# EAGLE design teensy_shield (EAGLE 7.2.0)
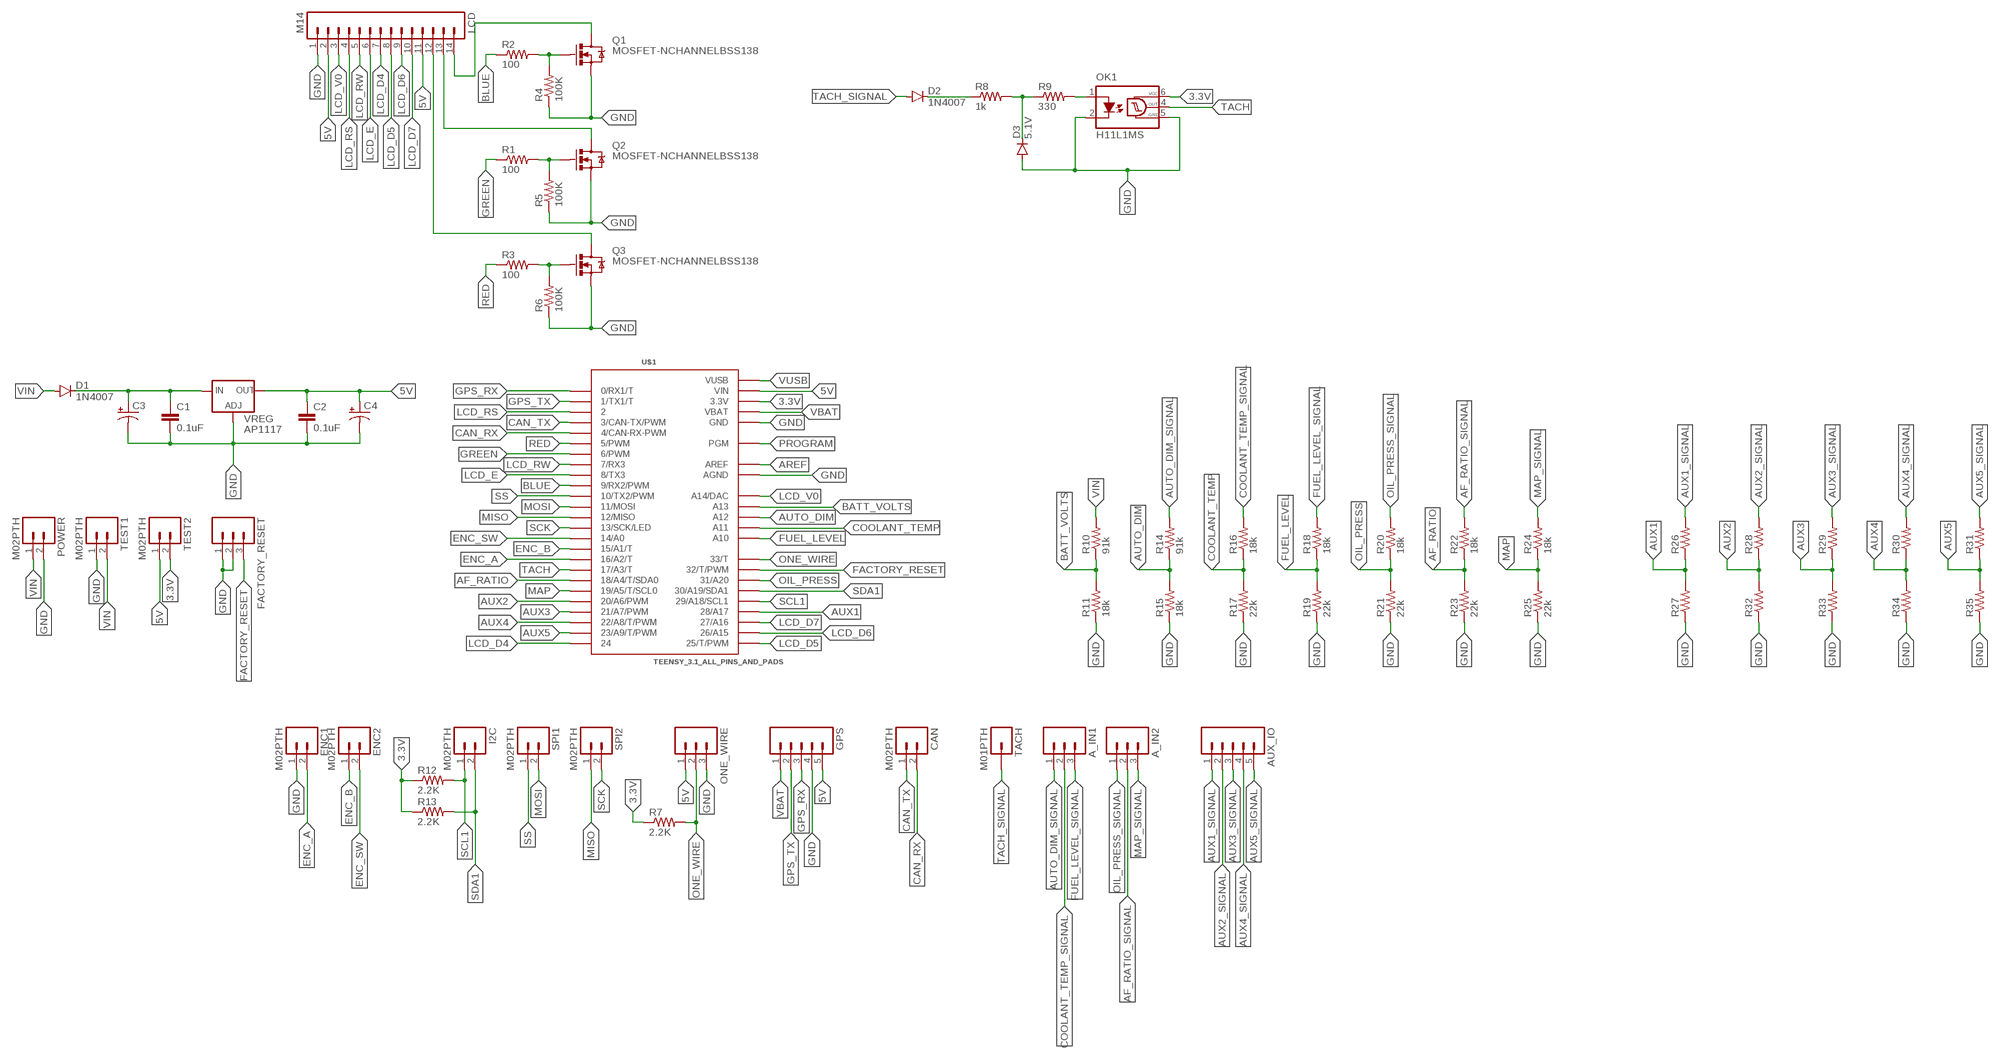
[diagram p0: schematic, sheet 1]

## Parts
A_IN1  M03PTH  [1X03]
A_IN2  M03PTH  [1X03]
AUX_IO  M05PTH  [1X05]
C1  0.1uF  CAP1206  [1206]
C2  0.1uF  CAP1206  [1206]
C3  CAP_POL6032  [EIA6032]
C4  CAP_POL6032  [EIA6032]
CAN  M02PTH  [1X02]
D1  1N4007  DIODESMA-ALT  [SMA-DIODE_ALT]
D2  1N4007  DIODESMA-ALT  [SMA-DIODE_ALT]
D3  5.1V  DIODESMA-ALT  [SMA-DIODE_ALT]
ENC1  M02PTH  [1X02]
ENC2  M02PTH  [1X02]
FACTORY_RESET  M03PTH  [1X03]
GPS  M05PTH  [1X05]
I2C  M02PTH  [1X02]
LCD  M14  [1X14]
OK1  H11L1MS  [DIL6-SMD]
ONE_WIRE  M03PTH  [1X03]
POWER  M02PTH  [1X02]
Q1  MOSFET-NCHANNELBSS138  [SOT23]
Q2  MOSFET-NCHANNELBSS138  [SOT23]
Q3  MOSFET-NCHANNELBSS138  [SOT23]
R1  100  RESISTOR1206  [1206]
R2  100  RESISTOR1206  [1206]
R3  100  RESISTOR1206  [1206]
R4  100K  RESISTOR1206  [1206]
R5  100K  RESISTOR1206  [1206]
R6  100K  RESISTOR1206  [1206]
R7  2.2K  RESISTOR1206  [1206]
R8  1k  RESISTOR1206  [1206]
R9  330  RESISTOR1206  [1206]
R10  91k  RESISTOR1206  [1206]
R11  18k  RESISTOR1206  [1206]
R12  2.2K  RESISTOR1206  [1206]
R13  2.2K  RESISTOR1206  [1206]
R14  91k  RESISTOR1206  [1206]
R15  18k  RESISTOR1206  [1206]
R16  18k  RESISTOR1206  [1206]
R17  22k  RESISTOR1206  [1206]
R18  18k  RESISTOR1206  [1206]
R19  22k  RESISTOR1206  [1206]
R20  18k  RESISTOR1206  [1206]
R21  22k  RESISTOR1206  [1206]
R22  18k  RESISTOR1206  [1206]
R23  22k  RESISTOR1206  [1206]
R24  18k  RESISTOR1206  [1206]
R25  22k  RESISTOR1206  [1206]
R26  RESISTOR1206  [1206]
R27  RESISTOR1206  [1206]
R28  RESISTOR1206  [1206]
R29  RESISTOR1206  [1206]
R30  RESISTOR1206  [1206]
R31  RESISTOR1206  [1206]
R32  RESISTOR1206  [1206]
R33  RESISTOR1206  [1206]
R34  RESISTOR1206  [1206]
R35  RESISTOR1206  [1206]
SPI1  M02PTH  [1X02]
SPI2  M02PTH  [1X02]
TACH  M01PTH  [1X01]
TEST1  M02PTH  [1X02]
TEST2  M02PTH  [1X02]
U$1  TEENSY_3.1_ALL_PINS_AND_PADS  [TEENSY_3.1_ALLPINS]
VREG  AP1117  V_REG_317SMD  [SOT223]

## Nets
3.3V: OK1.6(VCC) R7.1 R12.1 R13.1 TEST2.2 U$1.3.3V U$1.3.3V1(3.3V) U$1.3.3V2(3.3V)
5V: C2.1 C4.P$1(+) GPS.5 LCD.2 LCD.11 ONE_WIRE.1 TEST2.1 U$1.VIN VREG.2(OUT)
AF_RATIO: R22.1 R23.2 U$1.18/A4(18/A4/T/SDA0)
AF_RATIO_SIGNAL: A_IN2.2 R22.2
AREF: U$1.AREF
AUTO_DIM: R14.1 R15.2 U$1.A12
AUTO_DIM_SIGNAL: A_IN1.1 R14.2
AUX1: R26.1 R27.2 U$1.28(28/A17)
AUX1_SIGNAL: AUX_IO.1 R26.2
AUX2: R28.1 R32.2 U$1.20/A6(20/A6/PWM)
AUX2_SIGNAL: AUX_IO.2 R28.2
AUX3: R29.1 R33.2 U$1.21/A7(21/A7/PWM)
AUX3_SIGNAL: AUX_IO.3 R29.2
AUX4: R30.1 R34.2 U$1.22/A8(22/A8/T/PWM)
AUX4_SIGNAL: AUX_IO.4 R30.2
AUX5: R31.1 R35.2 U$1.23/A9(23/A9/T/PWM)
AUX5_SIGNAL: AUX_IO.5 R31.2
BATT_VOLTS: R10.1 R11.2 U$1.A13
BLUE: R2.1 U$1.9(9/RX2/PWM)
CAN_RX: CAN.2 U$1.4(4/CAN-RX-PWM)
CAN_TX: CAN.1 U$1.3(3/CAN-TX/PWM)
COOLANT_TEMP: R16.1 R17.2 U$1.A11
COOLANT_TEMP_SIGNAL: A_IN1.2 R16.2
ENC_A: ENC1.2 U$1.16/A2(16/A2/T)
ENC_B: ENC2.1 U$1.15/A1(15/A1/T)
ENC_SW: ENC2.2 U$1.14/A0
FACTORY_RESET: FACTORY_RESET.3 U$1.32(32/T/PWM)
FUEL_LEVEL: R18.1 R19.2 U$1.A10
FUEL_LEVEL_SIGNAL: A_IN1.3 R18.2
GND: C1.2 C2.2 C3.P$2(-) C4.P$2(-) D3.A ENC1.1 FACTORY_RESET.1 FACTORY_RESET.2 GPS.4 LCD.1 OK1.2(C) OK1.5(GND) ONE_WIRE.3 POWER.2 Q1.2(S) Q2.2(S) Q3.2(S) R4.1 R5.1 R6.1 R11.1 R15.1 R17.1 R19.1 R21.1 R23.1 R25.1 R27.1 R32.1 R33.1 R34.1 R35.1 TEST1.1 U$1.AGND U$1.GND U$1.GND1(GND) U$1.GND2(GND) VREG.1(ADJ)
GPS_RX: GPS.3 U$1.0(0/RX1/T)
GPS_TX: GPS.2 U$1.1(1/TX1/T)
GREEN: R1.1 U$1.6(6/PWM)
LCD_D4: LCD.7 U$1.24
LCD_D5: LCD.8 U$1.25(25/T/PWM)
LCD_D6: LCD.9 U$1.26(26/A15)
LCD_D7: LCD.10 U$1.27(27/A16)
LCD_E: LCD.6 U$1.8(8/TX3)
LCD_RS: LCD.4 U$1.2
LCD_RW: LCD.5 U$1.7(7/RX3)
LCD_V0: LCD.3 U$1.A14(A14/DAC)
MAP: R24.1 R25.2 U$1.19/A5(19/A5/T/SCL0)
MAP_SIGNAL: A_IN2.3 R24.2
MISO: SPI2.1 U$1.12(12/MISO)
MOSI: SPI1.2 U$1.11(11/MOSI)
N$1: C1.1 C3.P$1(+) D1.C VREG.3(IN)
N$2: D2.C R8.1
N$3: D3.C R8.2 R9.1
N$5: OK1.1(A) R9.2
N$11: LCD.14 Q1.3(D)
N$46: LCD.13 Q2.3(D)
N$47: LCD.12 Q3.3(D)
N$48: Q1.1(G) R2.2 R4.2
N$51: Q2.1(G) R1.2 R5.2
N$52: Q3.1(G) R3.2 R6.2
OIL_PRESS: R20.1 R21.2 U$1.31(31/A20)
OIL_PRESS_SIGNAL: A_IN2.1 R20.2
ONE_WIRE: ONE_WIRE.2 R7.2 U$1.33(33/T)
PROGRAM: U$1.PGM
RED: R3.1 U$1.5(5/PWM)
SCK: SPI2.2 U$1.13(13/SCK/LED)
SCL1: I2C.1 R12.2 U$1.29(29/A18/SCL1)
SDA1: I2C.2 R13.2 U$1.30(30/A19/SDA1)
SS: SPI1.1 U$1.10(10/TX2/PWM)
TACH: OK1.4(OUT) U$1.17/A3(17/A3/T)
TACH_SIGNAL: D2.A TACH.1
VBAT: GPS.1 U$1.VBAT
VIN: D1.A POWER.1 R10.2 TEST1.2
VUSB: U$1.VUSB

## Library data of the parts
A_IN1 A_IN2 FACTORY_RESET ONE_WIRE = SparkFun-Connectors:M03: Header 3 Standard 3-pin 0.1" header. Use with straight break away headers (SKU : PRT-00116), right angle break away headers (PRT-00553), swiss pins (PRT-00743), machine pins (PRT-00117), and female headers (PRT-00115). Molex polarized connector foot print use with SKU : PRT-08232 with associated crimp pins and housings.
AUX_IO GPS = SparkFun-Connectors:M05: Header 5 Standard 5-pin 0.1" header. Use with straight break away headers (SKU : PRT-00116), right angle break away headers (PRT-00553), swiss pins (PRT-00743), machine pins (PRT-00117), and female headers (PRT-00115). Molex polarized connector foot print use with SKU : PRT-08230 with associated crimp pins and housings.
C1 C2 = SparkFun-Capacitors:CAP: Capacitor Standard 0603 ceramic capacitor, and 0.1" leaded capacitor.
C3 C4 = SparkFun-Capacitors:CAP_POL: Capacitor Polarized These are standard SMD and PTH capacitors. Normally 10uF, 47uF, and 100uF in electrolytic and tantalum varieties. Always verify the external diameter of the through hole cap, it varies with capacity, voltage, and manufacturer. The EIA devices should be standard.
CAN ENC1 ENC2 I2C POWER SPI1 SPI2 TEST1 TEST2 = SparkFun-Connectors:M02: Standard 2-pin 0.1" header. Use with - straight break away headers ( PRT-00116) - right angle break away headers (PRT-00553) - swiss pins (PRT-00743) - machine pins (PRT-00117) - female headers (PRT-00115) Molex polarized connector foot print use with: PRT-08233 with associated crimp pins and housings. 2.54_SCREWTERM for use with PRT-10571. 3.5mm Screw Terminal footprints for PRT-08084 5mm Screw Terminal footprints for use with PRT-08433
D1-D3 = SparkFun-DiscreteSemi:DIODE: Diode These are standard reverse protection diodes and small signal diodes. SMA package can handle up to about 1A. SOD-323 can handle about 200mA. What the SOD-323 package when ordering, there are some mfgs out there that are 5-pin packages.
LCD = SparkFun-Connectors:M14: Header 14 Standard 14-pin 0.1" header. Use with straight break away headers (SKU : PRT-00116), right angle break away headers (PRT-00553), swiss pins (PRT-00743), machine pins (PRT-00117), and female headers (PRT-00115).
OK1 = optocoupler:H11L*M: 6-Pin DIP Optocoupler Source: http://www.fairchildsemi.com/ds/H1/H11L2-M.pdf; OC_FARNELL: unknown; OC_NEWARK: unknown
Q1-Q3 = SparkFun-DiscreteSemi:MOSFET-NCHANNEL: Common NMOSFET Parts MFG P/N Store ID Prod ID FDD8780 TRANS-09984 SI7820DN TRANS-11055 FDS6630A IC-08089 2N7002PW TRANS-11151 FQP30N06L COM-10213 TRANS-10060 BSS123LT1G TRANS-08345 BSS138 TRANS-00830 BS170 2N7000; PROD_ID: TRANS-00830
R1-R35 = SparkFun-Resistors:RESISTOR: Resistor Basic schematic elements and footprints for 0603, 1206, and PTH resistors.
TACH = SparkFun-Connectors:M01: Header 1 Standard 1-pin 0.1" header. Use with straight break away headers (SKU : PRT-00116), right angle break away headers (PRT-00553), swiss pins (PRT-00743), machine pins (PRT-00117), and female headers (PRT-00115).
U$1 = Teensy_3_Series_Board_v1.0:TEENSY_3.1_ALL_PINS_AND_PADS: Footprint for Teensy 3.1 board using all pads and all through-holes. Pads need a 2x7 0.1" SMD header.
VREG = SparkFun-PowerIC:V_REG_317: Voltage Regulator Standard LM317 adjustable voltage regulator. AOI (Adjust Output Input). Google 'LM317 Calculator' for easy to use app to get the two resistor values needed. 240/720 for 5V output. 240/390 for 3.3V output. Spark Fun Electronics SKU : COM-00527

## Board
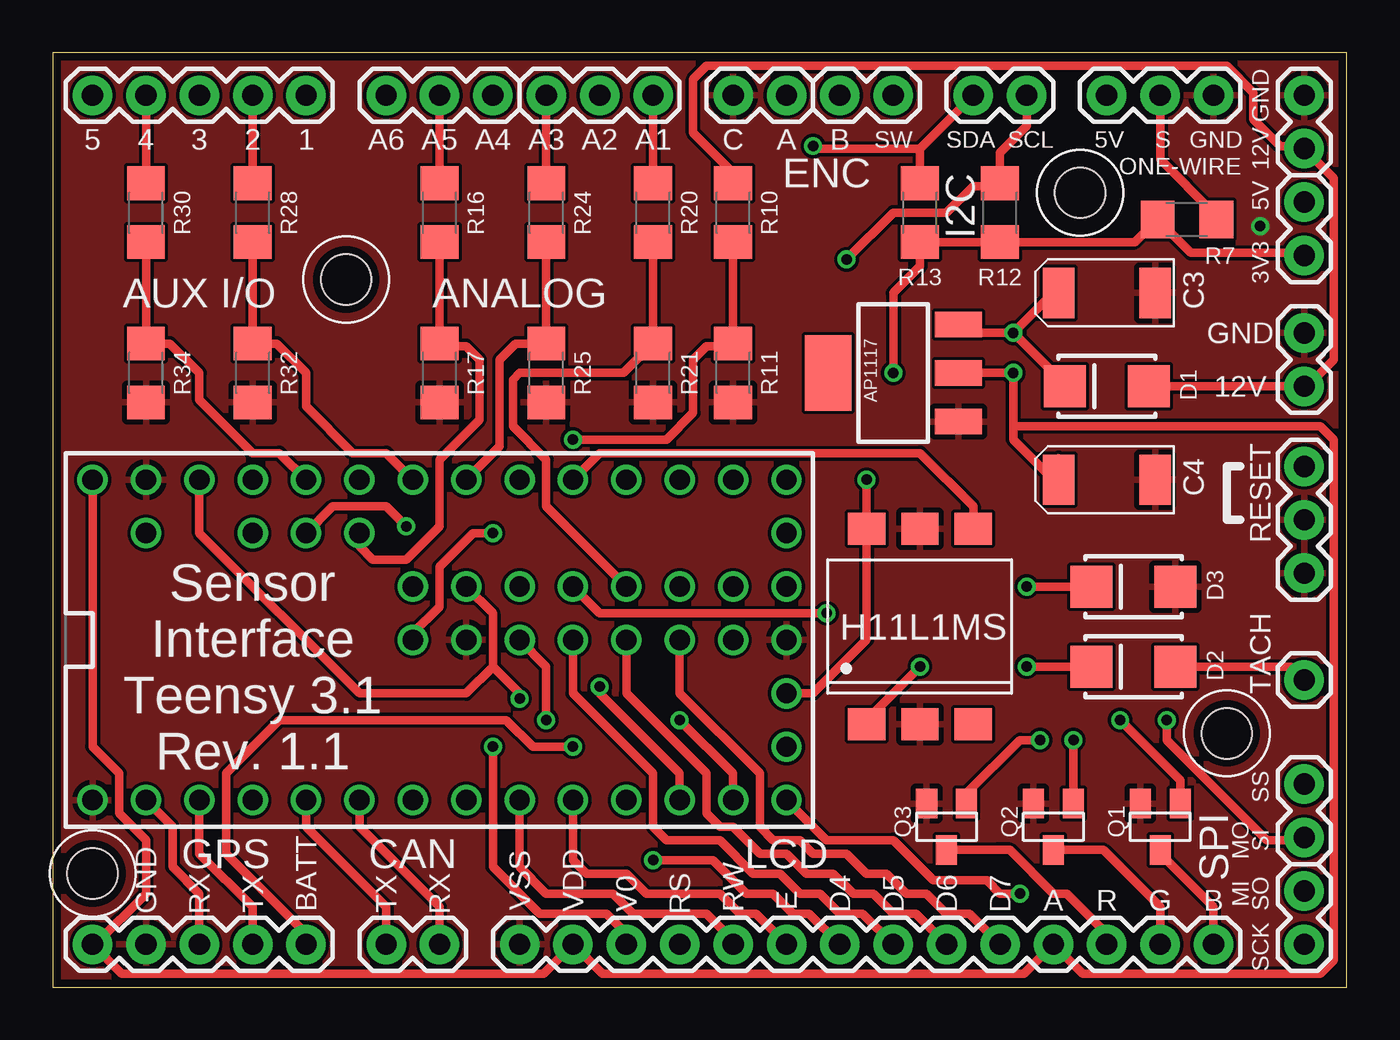
[diagram p1: board, top side]
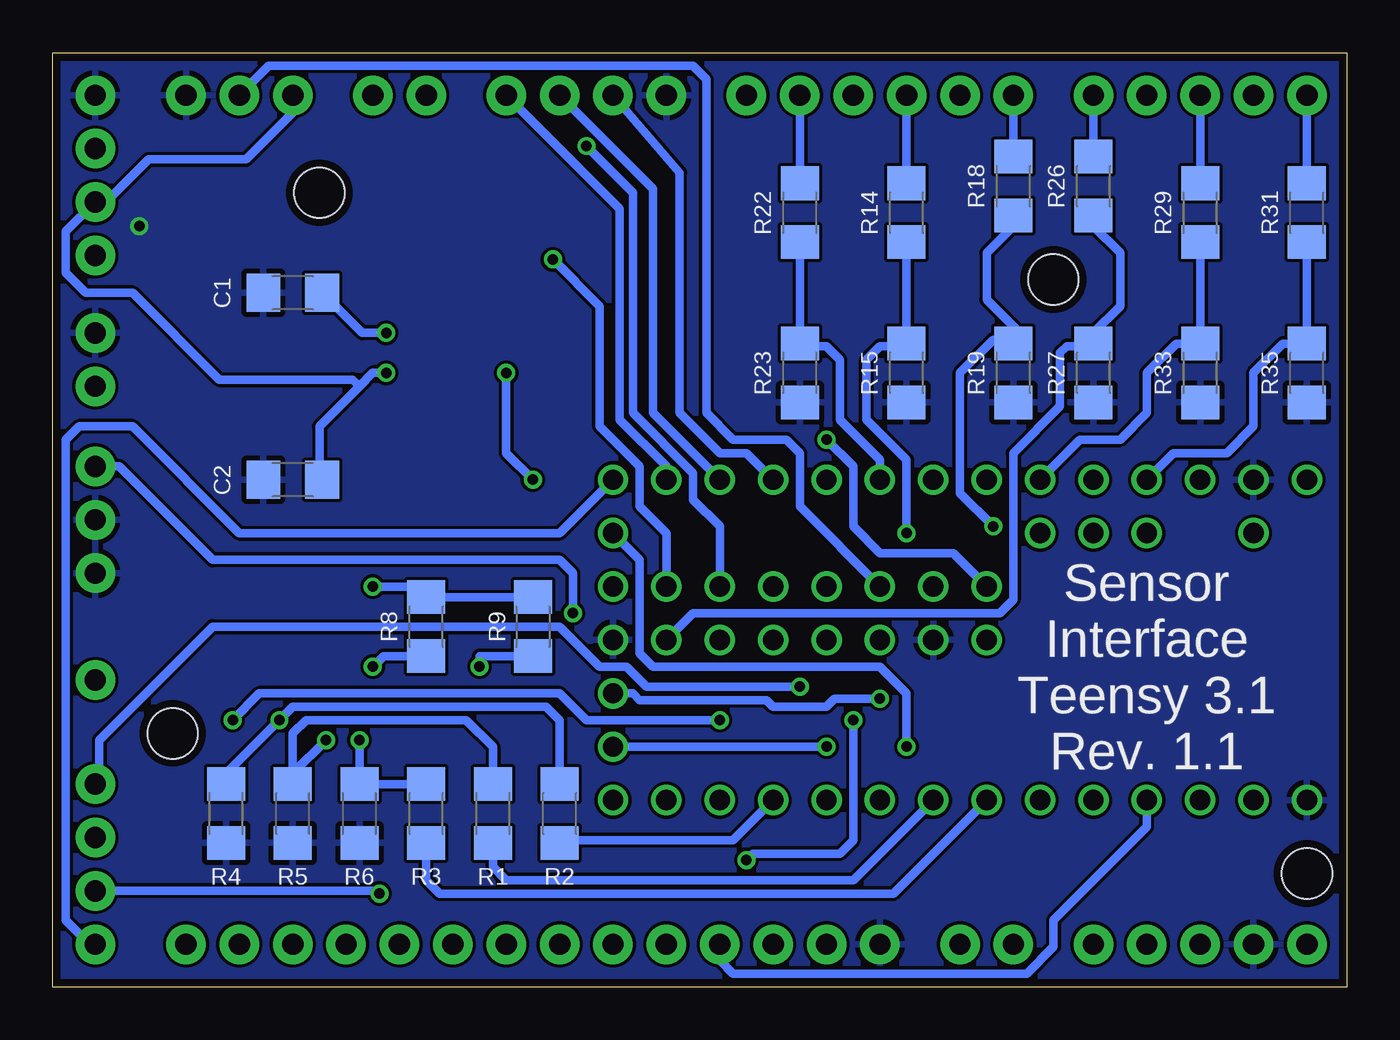
[diagram p2: board, bottom side, seen from below]

Size 61.59 x 44.45 mm. Coordinates in mm from the lower left corner, seen from the top.
Outline: 0,0 61.59,0 61.59,44.45 0,44.45 0,0
Copper layers (1*16): Top 0.0356mm / dielectric 1.5011mm / Bottom 0.0356mm
Design rules "oshparkPCB": minimum track width 6mil, minimum drill 13mil, track to track 6mil, track to pad 6mil, pad to pad 6mil, via to via 6mil, smd to smd 6mil, copper to edge 15mil, drill to drill 6mil, minimum pad ring 7mil, minimum via ring 7mil, stop-mask expansion 3mil, vias tented up to drill 0mil, thermal gap 10mil
Holes 2.39 mm at 1.91,5.4 13.97,33.66 48.9,37.78 55.88,12.06

### Footprints (pad centres in the part's own frame; a part is rotated, then mirrored left to right if it is on the bottom)
1X03 = drill 1.016 pad 1.88: 1 0,0; 2 2.54,0; 3 5.08,0
1X05 = drill 1.016 pad 1.88: 1 0,0; 2 2.54,0; 3 5.08,0; 4 7.62,0; 5 10.16,0
1206 = smd 1.6 x 1.8: 1 -1.4,0; 2 1.4,0
EIA6032 = smd 1.5 x 2.4: P$1 -2.3,0; P$2 2.3,0
1X02 = drill 1.016 pad 1.88: 1 0,0; 2 2.54,0
SMA-DIODE_ALT = smd 2 x 2: A -2,0; C 2,0
1X14 = drill 1.016 pad 1.88: 1 0,0; 2 2.54,0; 3 5.08,0; 4 7.62,0; 5 10.16,0; 6 12.7,0; 7 15.24,0; 8 17.78,0; 9 20.32,0; 10 22.86,0; 11 25.4,0; 12 27.94,0; 13 30.48,0; 14 33.02,0
DIL6-SMD = smd 1.78 x 1.52: 1 -2.54,-4.645; 2 0,-4.645; 3 2.54,-4.645; 4 2.54,4.645; 5 0,4.645; 6 -2.54,4.645
SOT23 = smd 1 x 1.4: 1 -0.95,-1.1; 2 0.95,-1.1; 3 0,1.1
1X01 = drill 1.016 pad 1.88: 1 0,0
TEENSY_3.1_ALLPINS = drill 0.965: 0 -7.62,15.24; 1 -7.62,12.7; 2 -7.62,10.16; 3 -7.62,7.62; 3.3V 7.62,12.7; 3.3V1 -2.54,-15.24; 3.3V2 2.54,0; 4 -7.62,5.08; 5 -7.62,2.54; 6 -7.62,0; 7 -7.62,-2.54; 8 -7.62,-5.08; 9 -7.62,-7.62; 10 -7.62,-10.16; 11 -7.62,-12.7; 12 -7.62,-15.24; 13 7.62,-15.24; 14/A0 7.62,-12.7; 15/A1 7.62,-10.16; 16/A2 7.62,-7.62; 17/A3 7.62,-5.08; 18/A4 7.62,-2.54; 19/A5 7.62,0; 20/A6 7.62,2.54; 21/A7 7.62,5.08; 22/A8 7.62,7.62; 23/A9 7.62,10.16; 24 0,-2.54; 25 0,-5.08; 26 0,-7.62; 27 0,-10.16; 28 0,-12.7; 29 2.54,-12.7; 30 2.54,-10.16; 31 2.54,-7.62; 32 2.54,-5.08; 33 2.54,-2.54; A10 5.08,7.62; A11 5.08,5.08; A12 0,2.54; A13 2.54,2.54; A14 5.08,-15.24; AGND 7.62,15.24; AREF 5.08,10.16; GND -7.62,17.78; GND1 0,-15.24; GND2 0,0; PGM 2.54,-15.24; VBAT -5.08,-15.24; VIN 7.62,17.78; VUSB 5.08,15.24
SOT223 = smd 1.219 x 2.235: 1 -2.311,-3.099; 2 0,-3.099; 3 2.311,-3.099 | smd 3.6 x 2.2: 4 0,3.099

### Placement (x,y rotation side)
A_IN1  20.95,42.42 180 top
A_IN2  28.57,42.42 180 top
AUX_IO  12.06,42.42 180 top
C1  50.16,33.02 180 bottom
C2  50.16,24.13 180 bottom
C3  50.16,33.02 0 top
C4  50.16,24.13 0 top
CAN  15.88,2.03 0 top
D1  50.16,28.57 180 top
D2  51.44,15.24 180 top
D3  51.44,19.05 180 top
ENC1  32.38,42.42 0 top
ENC2  37.47,42.42 0 top
FACTORY_RESET  59.56,19.68 90 top
GPS  12.06,2.03 180 top
I2C  46.35,42.42 180 top
LCD  22.23,2.03 0 top
OK1  41.27,17.14 0 top
ONE_WIRE  50.16,42.42 0 top
POWER  59.56,28.57 90 top
Q1  52.7,7.62 180 top
Q2  47.62,7.62 180 top
Q3  42.55,7.62 180 top
R1  40.64,8.26 90 bottom
R2  37.47,8.26 90 bottom
R3  43.81,8.26 90 bottom
R4  53.34,8.26 90 bottom
R5  50.16,8.26 90 bottom
R6  46.99,8.26 90 bottom
R7  53.98,36.51 0 top
R8  43.81,17.14 90 bottom
R9  38.73,17.14 270 bottom
R10  32.38,36.83 90 top
R11  32.38,29.21 90 top
R12  45.09,36.83 90 top
R13  41.27,36.83 90 top
R14  20.95,36.83 90 bottom
R15  20.95,29.21 90 bottom
R16  18.41,36.83 90 top
R17  18.41,29.21 90 top
R18  15.88,38.1 90 bottom
R19  15.88,29.21 90 bottom
R20  28.57,36.83 90 top
R21  28.57,29.21 90 top
R22  26.04,36.83 90 bottom
R23  26.04,29.21 90 bottom
R24  23.5,36.83 90 top
R25  23.5,29.21 90 top
R26  12.06,38.1 90 bottom
R27  12.06,29.21 90 bottom
R28  9.53,36.83 90 top
R29  6.99,36.83 90 bottom
R30  4.45,36.83 90 top
R31  1.91,36.83 90 bottom
R32  9.53,29.21 90 top
R33  6.99,29.21 90 bottom
R34  4.45,29.21 90 top
R35  1.91,29.21 90 bottom
SPI1  59.56,9.65 270 top
SPI2  59.56,4.57 270 top
TACH  59.56,14.61 90 top
TEST1  59.56,42.42 270 top
TEST2  59.56,37.34 270 top
U$1  19.68,16.51 90 top
VREG  40.01,29.21 90 top

### Tracks (layer width: path | path; a pad name or v marks a point on that pad's centre or on a via)
3.3V  (via drill 0.5 pad 0.25)
  Top 0.406: U$1.3.3V1 36.2,13.97 38.73,16.51 OK1.6 v38.73,24.13 | v40.01,29.21 40.01,33.02 41.27,34.29 R13.1 R12.1 51.49,35.43 R7.1 | U$1.3.3V2 20.95,17.78 20.95,15.24 | 20.95,15.24 19.68,13.97 14.61,13.97 6.99,21.59 U$1.3.3V | v22.23,13.72 22.23,13.97 20.95,15.24 | R7.1 53.02,36.51 | TEST2.2 59.44,34.92 54.16,34.92 R7.1
  Bottom 0.406: v40.01,29.21 40.01,25.4 v38.73,24.13 | U$1.3.3V1 33.97,13.97 33.66,13.65 27.62,13.65 27.3,13.34 24.77,13.34 24.38,13.72 v22.23,13.72
5V  (via drill 0.5 pad 0.25)
  Top 0.406: U$1.VIN 1.91,11.43 3.17,10.16 3.17,8.26 4.45,6.99 4.45,4.45 2.03,2.03 GPS.5 3.3,0.64 23.37,0.64 LCD.2 26.16,0.64 46.23,0.64 LCD.11 49.02,0.64 60.33,0.64 60.96,1.27 60.96,26.04 60.33,26.67 45.72,26.67 | 47.87,25.16 C4.P$1 47.62,24.13 45.72,26.04 45.72,26.67 | VREG.2 v45.72,29.21 45.72,26.67
  Bottom 0.406: v45.72,29.21 46.35,29.21 46.99,28.57 | 46.99,28.57 48.9,26.67 48.9,24.26 C2.1 | ONE_WIRE.1 50.16,41.59 52.39,39.37 57.02,39.37 59.05,37.34 TEST2.1 60.96,35.94 60.96,33.97 60.01,33.02 57.78,33.02 53.66,28.89 47.31,28.89 46.99,28.57
AF_RATIO
  Bottom 0.406: R22.1 R23.2 25.91,30.48 24.77,30.48 24.13,29.84 24.13,26.99 22.23,25.08 U$1.18/A4
AF_RATIO_SIGNAL
  Bottom 0.406: A_IN2.2 R22.2
AUTO_DIM  (via drill 0.5 pad 0.25)
  Top 0.406: U$1.A12 17.14,16.83 18.41,18.1 18.41,20 20,21.59 v20.95,21.59
  Bottom 0.406: R14.1 R15.2 21.09,30.48 22.23,30.48 22.86,29.84 22.86,26.99 20.95,25.08 v20.95,21.59
AUTO_DIM_SIGNAL
  Bottom 0.406: A_IN1.1 R14.2
AUX1
  Bottom 0.406: U$1.28 31.11,17.78 16.51,17.78 15.88,18.41 15.88,25.4 13.65,27.62 13.65,30.16 13.34,30.48 12.2,30.48 R27.2 12.06,31.11 10.79,32.38 10.79,34.92 12.06,36.2 R26.1
AUX1_SIGNAL
  Bottom 0.406: AUX_IO.1 R26.2
AUX2
  Top 0.406: R28.1 R32.2 10.66,30.61 12.06,29.21 12.06,27.62 14.29,25.4 15.88,25.4 U$1.20/A6
AUX2_SIGNAL
  Top 0.406: AUX_IO.2 R28.2
AUX3
  Bottom 0.406: R29.1 R33.2 8.12,30.61 9.53,29.21 9.53,27.3 10.79,26.04 12.7,26.04 U$1.21/A7
AUX3_SIGNAL
  Bottom 0.406: AUX_IO.3 R29.2
AUX4
  Top 0.406: R30.1 R34.2 5.58,30.61 6.99,29.21 6.99,27.94 9.53,25.4 10.79,25.4 U$1.22/A8
AUX4_SIGNAL
  Top 0.406: AUX_IO.4 R30.2
AUX5
  Bottom 0.406: R31.1 R35.2 3.04,30.61 4.45,29.21 4.45,26.67 5.71,25.4 8.26,25.4 U$1.23/A9
AUX5_SIGNAL
  Bottom 0.406: AUX_IO.5 R31.2
BATT_VOLTS  (via drill 0.5 pad 0.25)
  Top 0.406: R10.1 R11.2 32.26,30.48 31.11,30.48 30.48,29.84 30.48,27.3 29.21,26.04 v24.77,26.04
  Bottom 0.406: v24.77,26.04 23.5,24.77 23.5,21.91 22.23,20.64 18.73,20.64 U$1.A13
BLUE
  Bottom 0.406: 37.47,6.35 R2.1 37.34,6.99 29.21,6.99 U$1.9
CAN_RX
  Top 0.406: CAN.2 18.41,3.81 14.61,7.62 U$1.4
CAN_TX
  Top 0.406: U$1.3 12.06,7.62 15.88,3.81 CAN.1
COOLANT_TEMP
  Top 0.406: 18.29,30.48 R17.2 | R16.1 R17.2 | R17.2 18.55,30.48 19.68,30.48 20.32,29.84 20.32,26.99 18.41,25.08 18.41,21.91 16.83,20.32 15.24,20.32 14.61,20.95 U$1.A11
COOLANT_TEMP_SIGNAL
  Top 0.406: A_IN1.2 R16.2
ENC_A
  Bottom 0.406: U$1.16/A2 28.57,25.4 29.84,25.4 31.75,27.3 31.75,38.73 ENC1.2
ENC_B
  Bottom 0.406: U$1.15/A1 33.02,27.3 33.02,37.97 ENC2.1
ENC_SW
  Bottom 0.406: U$1.14/A0 32.38,24.77 34.61,26.99 34.61,37.02 ENC2.2
FACTORY_RESET  (via drill 0.5 pad 0.25)
  Top 0.406: U$1.32 26.04,17.78 v36.83,17.78
  Bottom 0.406: v36.83,17.78 36.83,19.68 37.47,20.32 53.98,20.32 58.42,24.77 FACTORY_RESET.3
FUEL_LEVEL  (via drill 0.5 pad 0.25)
  Top 0.406: U$1.A10 13.34,22.86 15.88,22.86 v16.83,21.91
  Bottom 0.406: 16,30.48 R19.2 | R18.1 15.88,36.2 17.14,34.92 17.14,32.7 15.56,31.11 15.56,30.93 R19.2 | R19.2 16.06,30.8 16.83,30.8 18.41,29.21 18.41,23.5 v16.83,21.91
FUEL_LEVEL_SIGNAL
  Bottom 0.406: A_IN1.3 R18.2
GND  (via drill 0.5 pad 0.25)
  other vias: 57.47,36.2
  pour Bottom: -2.54,48.26 63.5,48.26 63.5,0 -1.27,0
  pour Top: -1.27,46.99 63.5,46.99 63.5,-1.27 -1.27,-1.27
GPS_RX
  Top 0.406: U$1.0 5.71,7.62 5.71,5.71 6.99,4.45 GPS.3
GPS_TX
  Top 0.406: U$1.1 6.99,6.35 9.53,3.81 GPS.2
GREEN
  Bottom 0.406: U$1.6 23.5,5.08 40.01,5.08 40.64,5.71 R1.1
LCD_D4  (via drill 0.5 pad 0.25)
  Top 0.406: U$1.24 23.5,15.24 v23.5,12.7 | v28.57,6.03 31.43,6.03 33.02,4.45 34.29,4.45 35.24,3.49 36.01,3.49 LCD.7
  Bottom 0.406: v23.5,12.7 23.5,6.99 24.13,6.35 28.26,6.35 v28.57,6.03
LCD_D5
  Top 0.406: U$1.25 24.77,13.97 28.57,10.16 28.57,7.62 29.21,6.99 31.75,6.99 33.34,5.4 34.61,5.4 35.56,4.45 36.51,4.45 37.47,3.49 38.54,3.49 LCD.8
LCD_D6
  Top 0.406: U$1.26 27.3,13.97 31.11,10.16 31.11,8.26 31.75,7.62 32.38,7.62 33.66,6.35 34.92,6.35 35.88,5.4 37.15,5.4 38.1,4.45 39.05,4.45 40.01,3.49 41.08,3.49 LCD.9
LCD_D7
  Top 0.406: U$1.27 29.84,13.97 33.66,10.16 33.66,7.62 34.29,6.99 35.56,6.99 36.2,6.35 37.78,6.35 38.73,5.4 39.69,5.4 40.64,4.45 41.59,4.45 42.55,3.49 43.62,3.49 LCD.10
LCD_E
  Top 0.406: U$1.8 24.77,6.03 25.4,5.4 27.3,5.4 28.26,4.45 31.75,4.45 32.7,3.49 33.47,3.49 LCD.6
LCD_RS
  Bottom 0.406: LCD.4 29.84,1.27 29.21,0.64 15.24,0.64 13.97,1.91 13.97,3.17 9.53,7.62 U$1.2
LCD_RW
  Top 0.406: U$1.7 22.23,5.71 23.5,4.45 26.67,4.45 27.62,3.49 31.11,3.49 32.38,2.22 LCD.5
LCD_V0  (via drill 0.5 pad 0.25)
  Top 0.406: LCD.3 27.3,2.54 26.35,3.49 23.18,3.49 20.95,5.71 v20.95,11.43
  Bottom 0.406: U$1.A14 33.66,20.32 33.66,15.88 33.02,15.24 22.23,15.24 20.95,13.97 v20.95,11.43
MAP
  Top 0.406: R24.1 R25.2 22.04,30.61 21.27,29.84 21.27,25.72 U$1.19/A5
MAP_SIGNAL
  Top 0.406: A_IN2.3 R24.2
MISO  (via drill 0.5 pad 0.25)
  Top 0.406: U$1.12 36.83,6.99 40.01,6.99 41.91,5.08 44.45,5.08 45.09,4.45 v46.04,4.45
  Bottom 0.406: 59.44,4.45 SPI2.1 46.16,4.57 v46.04,4.45
MOSI  (via drill 0.5 pad 0.25)
  Top 0.406: U$1.11 32.38,10.16 v29.84,12.7 | SPI1.2 59.44,6.99 57.78,6.99 53.02,11.75 v53.02,12.7
  Bottom 0.406: v29.84,12.7 36.2,12.7 37.47,13.97 51.75,13.97 v53.02,12.7
N$1  (via drill 0.5 pad 0.25)
  Top 0.406: C3.P$1 47.62,33.02 v45.72,31.11 | v45.72,31.11 43.51,31.11 VREG.3 | D1.C 48.16,28.67 v45.72,31.11
  Bottom 0.406: v45.72,31.11 46.86,31.11 C1.1
N$2  (via drill 0.5 pad 0.25)
  Top 0.406: v46.35,15.24 D2.C
  Bottom 0.406: R8.1 45.85,15.74 v46.35,15.24
N$3  (via drill 0.5 pad 0.25)
  Top 0.406: D3.C v46.35,19.05
  Bottom 0.406: v46.35,19.05 44.32,19.05 R8.2 R9.1
N$5  (via drill 0.5 pad 0.25)
  Top 0.406: v41.27,15.24 38.73,12.7 OK1.1
  Bottom 0.406: R9.2 41.27,15.74 v41.27,15.24
N$11
  Top 0.406: Q1.3 52.7,6.35 55.24,3.81 LCD.14
N$46
  Top 0.406: Q2.3 49.99,6.52 52.7,3.81 LCD.13
N$47
  Top 0.406: Q3.3 44.45,6.52 44.91,6.52 45.55,6.52 47.62,4.45 48.26,4.45 50.16,2.54 LCD.12
N$48  (via drill 0.5 pad 0.25)
  Top 0.406: Q1.1 53.66,9.85 v50.8,12.7
  Bottom 0.406: R4.2 53.34,10.16 52.07,11.43 v50.8,12.7 50.16,13.34 38.1,13.34 37.47,12.7 R2.2
N$51  (via drill 0.5 pad 0.25)
  Top 0.406: Q2.1 v48.58,11.75
  Bottom 0.406: R5.2 50.16,10.16 | 50.16,10.16 50.16,12.06 49.53,12.7 41.91,12.7 40.64,11.43 R1.2 | v48.58,11.75 50.16,10.16
N$52  (via drill 0.5 pad 0.25)
  Top 0.406: Q3.1 43.49,9.21 46.04,11.75 v46.99,11.75
  Bottom 0.406: R3.2 R6.2 v46.99,11.75
OIL_PRESS
  Top 0.406: R20.1 R21.2 27.18,29.21 22.23,29.21 21.91,28.89 21.91,26.67 23.5,25.08 23.5,22.86 U$1.31
OIL_PRESS_SIGNAL
  Top 0.406: A_IN2.1 R20.2
ONE_WIRE
  Top 0.406: ONE_WIRE.2 52.7,39.37 55.24,36.83 55.24,36.64 R7.2
  Bottom 0.406: ONE_WIRE.2 51.31,43.81 31.11,43.81 30.48,43.18 30.48,27.3 29.21,26.04 26.67,26.04 26.04,25.4 26.04,22.86 U$1.33
RED
  Bottom 0.406: U$1.5 21.59,4.45 43.18,4.45 43.81,5.08 R3.1
SCK
  Bottom 0.406: U$1.13 37.47,21.59 52.7,21.59 57.78,26.67 60.33,26.67 60.96,26.04 60.96,3.17 59.82,2.03 SPI2.2
SCL1  (via drill 0.5 pad 0.25)
  Top 0.406: I2C.1 46.35,40.96 45.09,39.69 R12.2 44.95,38.1 43.81,38.1 42.55,36.83 40.01,36.83 v37.78,34.61
  Bottom 0.406: U$1.29 32.38,21.59 33.66,22.86 33.66,24.77 35.56,26.67 35.56,32.38 v37.78,34.61
SDA1  (via drill 0.5 pad 0.25)
  Top 0.406: 41.27,39.88 R13.2 | 41.27,39.88 I2C.2 | v36.2,40.01 36.32,39.88 41.27,39.88
  Bottom 0.406: U$1.30 29.84,21.91 31.11,23.18 31.11,24.45 33.97,27.3 33.97,37.78 v36.2,40.01
SS  (via drill 0.5 pad 0.25)
  Top 0.406: U$1.10 29.84,10.16 26.04,13.97 v26.04,14.29
  Bottom 0.406: v26.04,14.29 33.34,14.29 34.29,15.24 35.56,15.24 37.47,17.14 53.98,17.14 59.37,11.75 59.37,9.84 SPI1.1
TACH
  Top 0.406: U$1.17/A3 26.04,25.4 41.27,25.4 43.81,22.86 OK1.4
TACH_SIGNAL
  Top 0.406: 52.8,14.61 D2.A 58.93,15.24 TACH.1
VBAT  (via drill 0.5 pad 0.25)
  Top 0.406: GPS.1 12.06,2.54 8.26,6.35 8.26,10.16 10.79,12.7 21.59,12.7 22.86,11.43 v24.77,11.43
  Bottom 0.406: U$1.VBAT v24.77,11.43
VIN
  Top 0.406: R10.2 32.38,38.73 30.48,40.64 30.48,43.18 31.11,43.81 55.88,43.81 57.15,42.55 57.15,41.27 58.42,40.01 59.44,40.01 TEST1.2 60.96,38.48 60.96,29.84 59.37,28.26 POWER.1 D1.A

### Text on the board
tPlace: GND | 5 | 4 | 3 | 2 | 1 | A6 | A5 | A4 | A3 | A2 | A1 | C | A | B | SW | SDA | SCL | 5V | S | GND | 12V | ENC | ONE-WIRE | 5V | I2C | 3V3 | AUX I/O | ANALOG | C3 | GND | 12V | C4 | RESET | TACH | Sensor / Interface / Teensy 3.1 / Rev. 1.1 | SS | SPI | MO | SI | GPS | CAN | LCD | GND | BATT | VSS | VDD | RW | RX | TX | TX | RX | V0 | RS | E | D4 | D5 | D6 | D7 | A | R | G | B | MI | SO | SCK
bPlace: Sensor / Interface / Teensy 3.1 / Rev. 1.1